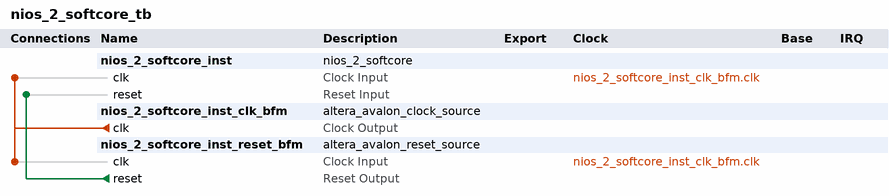
[diagram p0: system contents]
# Platform Designer (Qsys) system nios_2_softcore_tb, Cyclone IV E EP4CE6E22C8
# Parameters at their usual value, and those the tool derives, are not listed.
package require -exact qsys 13.0
create_system nios_2_softcore_tb
set_project_property DEVICE_FAMILY {Cyclone IV E}
set_project_property DEVICE EP4CE6E22C8

add_instance nios_2_softcore_inst nios_2_softcore 1.0

add_instance nios_2_softcore_inst_clk_bfm altera_avalon_clock_source 13.0

add_instance nios_2_softcore_inst_reset_bfm altera_avalon_reset_source 13.0
set_instance_parameter_value nios_2_softcore_inst_reset_bfm ASSERT_HIGH_RESET 0
set_instance_parameter_value nios_2_softcore_inst_reset_bfm INITIAL_RESET_CYCLES 50

# connections
add_connection nios_2_softcore_inst_clk_bfm.clk nios_2_softcore_inst.clk clock
add_connection nios_2_softcore_inst_clk_bfm.clk nios_2_softcore_inst_reset_bfm.clk clock
add_connection nios_2_softcore_inst_reset_bfm.reset nios_2_softcore_inst.reset reset

set_interconnect_requirement {$system} qsys_mm.clockCrossingAdapter HANDSHAKE
set_interconnect_requirement {$system} qsys_mm.maxAdditionalLatency 1

save_system nios_2_softcore_tb.qsys
